# EAGLE design Module_T+H_04vP (EAGLE 7.7.0)
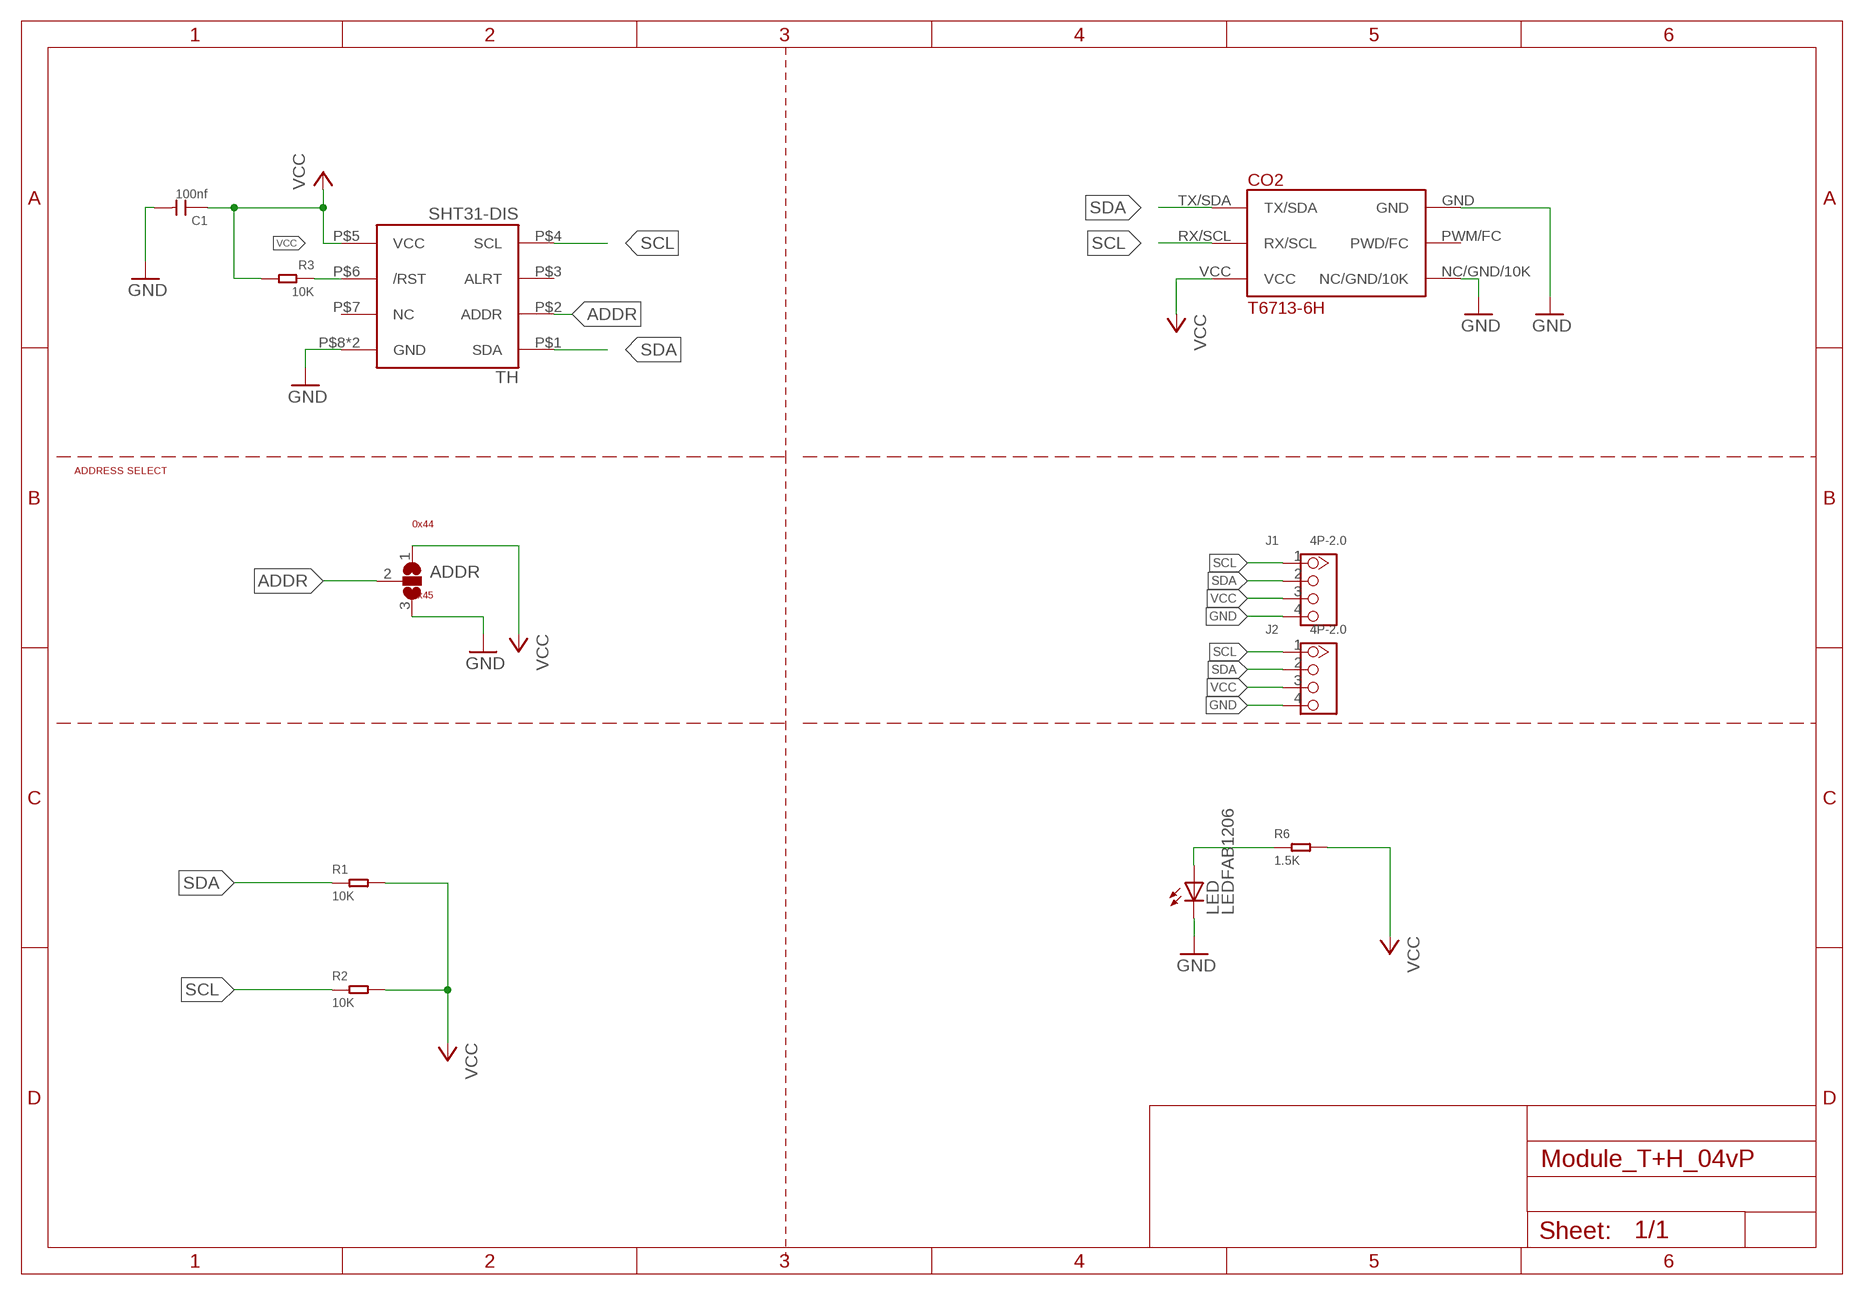
[diagram p0: schematic, sheet 1]

## Parts
ADDR  SJ2W  [SJ_2]
C1  100nf  CERAMIC-100NF-50V-10%-X7R(0805)  [C0805]
CO2  T6713-6H  [PINS]
J1  4P-2.0  GROVE-CONNECTOR-DIP(4P-2.0)  [HW4-2.0]
J2  4P-2.0  GROVE-CONNECTOR-DIP(4P-2.0)  [HW4-2.0]
LED  LEDFAB1206  [LED1206FAB]
R1  10K  SMD-RES-10K-1%-1/8W(0805)  [R0805]
R2  10K  SMD-RES-10K-1%-1/8W(0805)  [R0805]
R3  10K  SMD-RES-10K-1%-1/8W(0805)  [R0805]
R6  1.5K  SMD-RES-1.5K-1%-1/8W(0805)  [R0805]
TH  SHT31-DIS  [SHT3X]

## Nets
ADDR: ADDR.2 TH.P$2(ADDR)
GND: ADDR.3 C1.2 CO2.GND CO2.NC/GND/10K J1.4 J2.4 LED.2(C) TH.P$8(GND) TH.PAD(GND)
N$1: LED.1(A) R6.1
RST: R3.1 TH.P$6(/RST)
SCL: CO2.RX/SCL J1.1 J2.1 R2.1 TH.P$4(SCL)
SDA: CO2.TX/SDA J1.2 J2.2 R1.1 TH.P$1(SDA)
VCC: ADDR.1 C1.1 CO2.VCC J1.3 J2.3 R1.2 R2.2 R3.2 R6.2 TH.P$5(VCC)
Unconnected: CO2.PWM/FC(PWD/FC) TH.P$3(ALRT) TH.P$7(NC)

## Notes on the sheet
- ADDRESS SELECT
- 0x44
- 0x45

## Library data of the parts
ADDR = jumper:SJ2W: SMD solder JUMPER
C1 = Seeed-OPL-Capacitor:CERAMIC-100NF-50V-10%-X7R(0805): 302010165; MPN: CC0805KRX7R9BB104
CO2 = T6713-6H:T6713-6H
J1 J2 = Seeed-OPL-Connector:GROVE-CONNECTOR-DIP(4P-2.0): 320110033
LED = fab_2:LED: LED
R1-R3 = Seeed-OPL-Resistor:SMD-RES-10K-1%-1/8W(0805): 301010361; MPN: RC0805FR-0710KL
R6 = Seeed-OPL-Resistor:SMD-RES-1.5K-1%-1/8W(0805): 301010394; MPN: RC0805FR-071K5L
TH = thomasb9511:SHT31-DIS

## Board
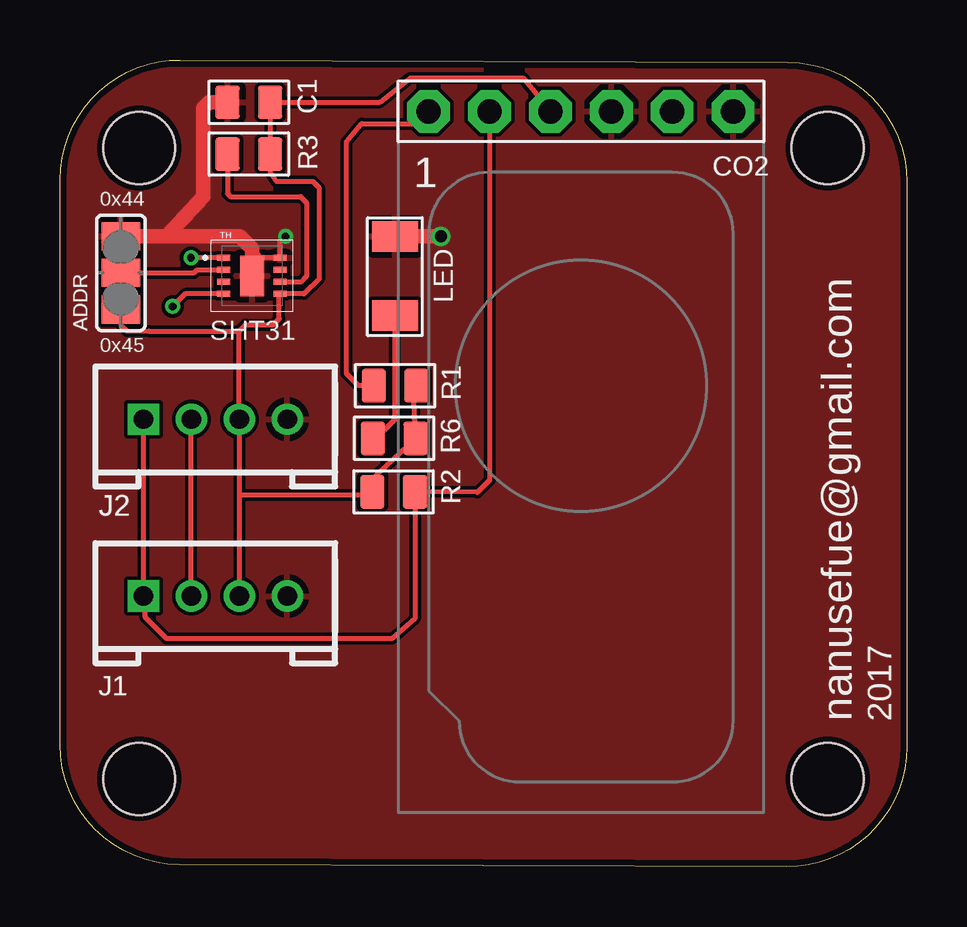
[diagram p1: board, top side]
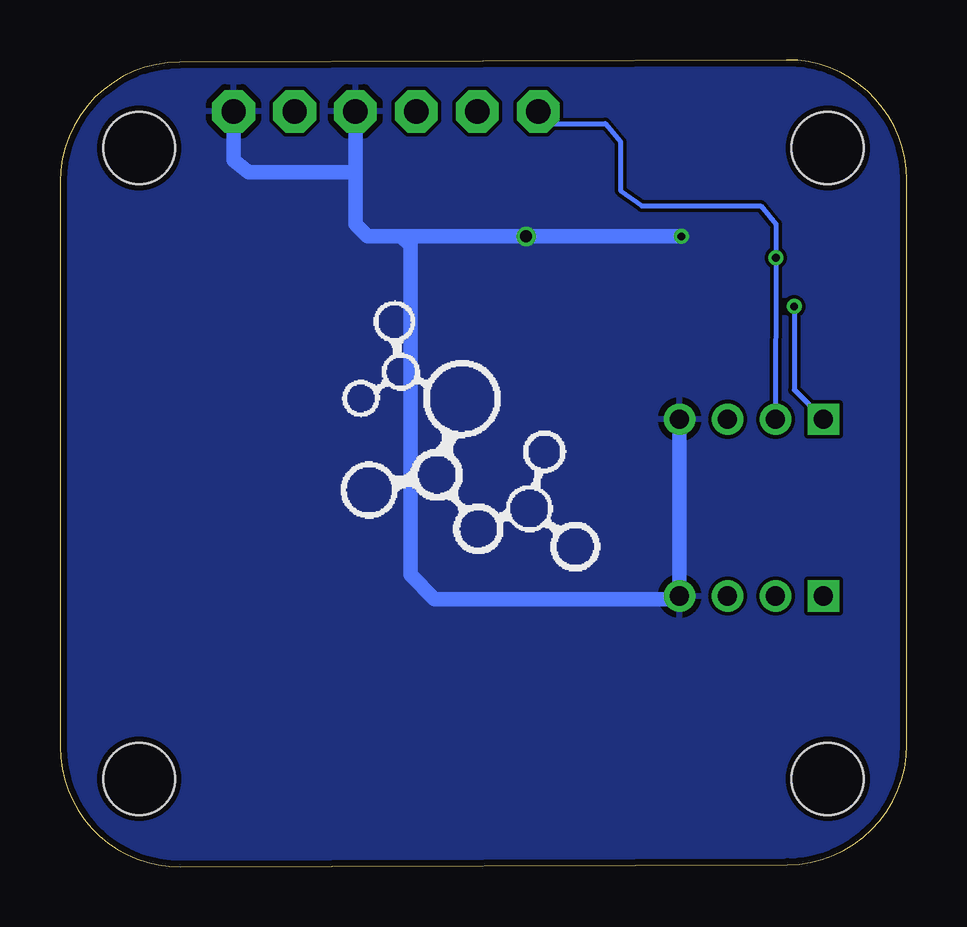
[diagram p2: board, bottom side, seen from below]

Size 35.31 x 33.62 mm. Coordinates in mm from the lower left corner, seen from the top.
Outline: 35.31,28.53 35.31,5 arc-90 30.29,0 4.98,0.09 arc-90 0,5.09 0,28.62 arc-90 5.02,33.62 30.32,33.53 arc-90 35.31,28.53
Copper layers (1*16): Top 0.035mm / dielectric 1.5mm / Bottom 0.035mm
Design rules "SeeedStudio_2layer_DRU_no_angle_20140221": minimum track width 6mil, minimum drill 12mil, track to track 6mil, track to pad 6mil, pad to pad 6mil, via to via 6mil, smd to smd 0mil, copper to edge 10mil, drill to drill 10mil, minimum pad ring 10mil, minimum via ring 6mil, stop-mask expansion 2mil, vias tented up to drill 100mil, thermal gap 10mil
Holes 3 mm at 3.3,29.95 32,29.95 32,3.66 3.3,3.66

### Footprints (pad centres in the part's own frame; a part is rotated, then mirrored left to right if it is on the bottom)
SJ_2 = smd 1.168 x 1.6: 1 -1.524,0; 2 0,0; 3 1.524,0
C0805 = smd 1.397 x 1.016: 1 0,0.889; 2 0,-0.889
PINS = drill 1.016 pad 1.778 octagon: GND 1.27,0; NC/GND/10K 6.35,0; PWM/FC 3.81,0; RX/SCL -3.81,0; TX/SDA -6.35,0; VCC -1.27,0
HW4-2.0 = drill 0.8 pad 1.27 square: 1 -3,0 | drill 0.8 pad 1.27: 2 -1,0; 3 1,0; 4 3,0
LED1206FAB = smd 1.27 x 1.905: 1 -1.651,0; 2 1.651,0
R0805 = smd 1.397 x 1.016: 1 0,0.889; 2 0,-0.889
SHT3X = smd 0.55 x 0.25: P$1 -1.175,0.75; P$2 -1.175,0.25; P$3 -1.175,-0.25; P$4 -1.175,-0.75; P$5 1.175,-0.75; P$6 1.175,-0.25; P$7 1.175,0.25; P$8 1.175,0.75 | smd 1 x 1.7: PAD 0,0

### Placement (x,y rotation side)
ADDR  2.54,24.75 90 top
C1  7.87,31.86 270 top
CO2  21.72,31.48 0 top
J1  6.48,11.28 0 top
J2  6.48,18.65 0 top
LED  13.97,24.62 90 top
R1  13.97,20.05 90 top
R2  13.91,15.62 270 top
R3  7.87,29.7 90 top
R6  13.93,17.86 90 top
TH  8,24.62 0 top

### Tracks (layer width: path | path; a pad name or v marks a point on that pad's centre or on a via)
ADDR
  Top 0.2: ADDR.2 5.59,24.75 5.71,24.87 TH.P$2
GND  (via drill 0.32 pad 0.5, 0.5 pad 0.5)
  Top 0.2: 8.12,25.37 TH.P$8 9.18,26.05 v9.4,26.27
  Top 0.6: ADDR.3 4.45,26.27 | 4.45,26.27 7.49,26.27 8,25.76 8,25.25 | 8,25.25 TH.PAD | C1.2 6.22,31.86 5.97,31.6 5.97,27.92 4.45,26.27 | 8.12,25.37 8,25.25 | v15.88,26.27 LED.2
  Bottom 0.6: 22.99,28.94 22.99,26.78 22.48,26.27 21.08,26.27 | 22.99,28.94 CO2.GND | CO2.NC/GND/10K 28.07,29.45 27.43,28.94 22.99,28.94 | v9.4,26.27 v15.88,26.27 21.08,26.27 | 21.08,26.27 20.7,25.89 20.7,12.17 19.68,11.16 9.53,11.16 | J2.4 J1.4
  pour Top: 5,0.11 30.43,0.11 arc90 35.43,5.11 35.43,28.64 arc90 30.43,33.64 5,33.64 arc90 0,28.64 0,5.11 arc90
  pour Bottom: 35.31,28.64 35.31,5.11 arc-90 30.31,0.11 5,0.11 arc-90 0,5.11 0,28.64 arc-90 5,33.64 30.31,33.64 arc-90
N$1
  Top 0.2: R6.1 13.21,17.89 13.97,18.65 LED.1
RST
  Top 0.2: R3.1 6.99,28.05 7.11,27.92 10.03,27.92 10.29,27.67 10.29,24.62 10.03,24.37 TH.P$6
SCL  (via drill 0.32 pad 0.31)
  Top 0.2: J2.1 J1.1 3.56,11.21 3.56,10.4 4.45,9.51 13.84,9.51 14.79,10.34 R2.1 17.4,15.6 17.91,16.11 CO2.RX/SCL | TH.P$4 5.22,23.87 v4.7,23.35
  Bottom 0.2: v4.7,23.35 4.7,19.87 J2.1
SDA  (via drill 0.32 pad 0.5)
  Top 0.2: J1.2 J2.2 | TH.P$1 5.6,25.37 v5.46,25.38 | R1.1 12.45,20.05 11.94,20.56 11.94,30.21 12.57,30.97 14.86,30.97 CO2.TX/SDA
  Bottom 0.2: J2.2 v5.46,25.38 5.46,26.78 6.1,27.54 11.05,27.54 11.94,28.18 11.94,30.21 12.57,30.97 14.86,30.97 CO2.TX/SDA
VCC
  Top 0.2: 7.48,15.48 J2.3 7.48,22.32 | 7.48,15.48 J1.3 | 7.48,15.48 12.95,15.48 R2.2 12.95,16.11 R6.2 14.73,19.92 R1.2 | 7.48,22.32 7.75,22.59 8.89,22.59 9.14,22.84 9.14,23.84 TH.P$5 10.17,23.87 10.79,24.49 10.79,28.3 10.54,28.56 9.02,28.56 8.76,28.94 R3.2 C1.1 13.34,31.86 14.61,32.87 19.3,32.87 CO2.VCC | ADDR.1 2.54,22.59 2.79,22.33 3.7,22.32 7.48,22.32

### Text on the board
tPlace: 0x44 | 0x45 | nanusefue@gmail.com | 2017
tNames: SHT31
_tPlace: CO2
_tNames: C1 | R3 | TH | LED | ADDR | R1 | R6 | J2 | R2 | J1